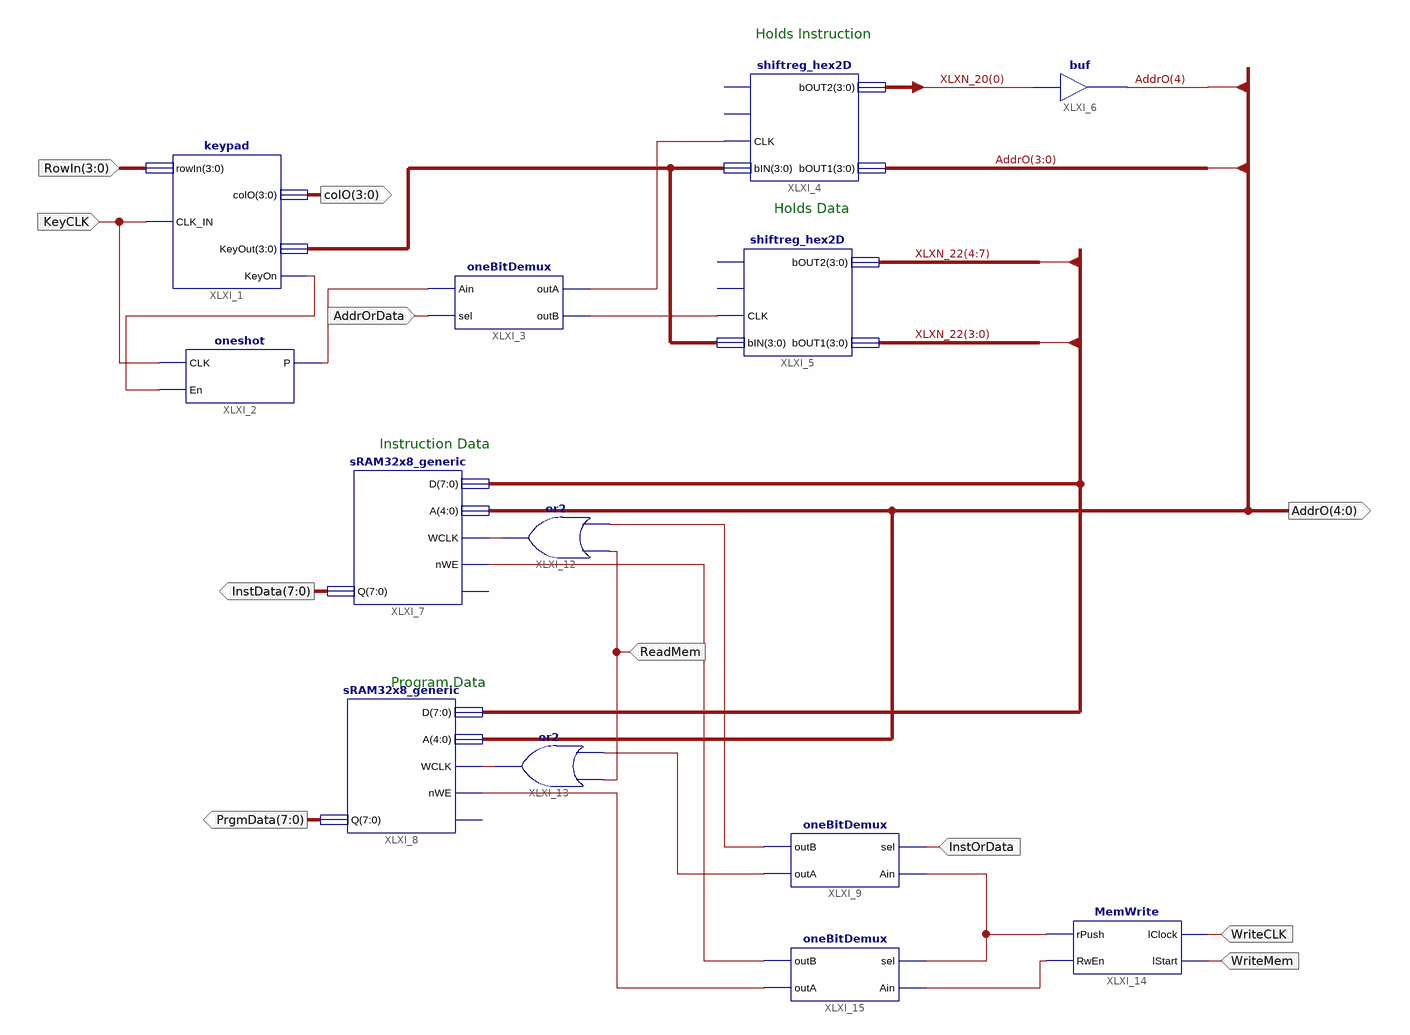
[diagram p0: schematic sheet 1]
// Xilinx ISE schematic KeyAndMem.sch (spartan3e) as structural Verilog: 13 symbols, 11 ports
module KeyAndMem (
  input  [3:0] RowIn,
  input  KeyCLK,
  input  AddrOrData,
  input  InstOrData,
  input  ReadMem,
  input  WriteMem,
  input  WriteCLK,
  output [3:0] colO,
  output [4:0] AddrO,
  output [7:0] InstData,
  output [7:0] PrgmData
);

  wire XLXN_4, XLXN_7, XLXN_9, XLXN_10, XLXN_33, XLXN_34, XLXN_35, XLXN_36, XLXN_38, XLXN_39, XLXN_40,
       XLXN_41;
  wire [3:0] XLXN_11, XLXN_20;
  wire [7:0] XLXN_22;

  keypad XLXI_1 (.rowIn(RowIn), .CLK_IN(KeyCLK), .colO(colO), .KeyOut(XLXN_11), .KeyOn(XLXN_4));
  oneshot XLXI_2 (.CLK(KeyCLK), .En(XLXN_4), .P(XLXN_7));
  oneBitDemux XLXI_3 (.Ain(XLXN_7), .sel(AddrOrData), .outA(XLXN_9), .outB(XLXN_10));
  shiftreg_hex2D XLXI_4 (.CLK(XLXN_9), .bIN(XLXN_11), .bOUT2(XLXN_20), .bOUT1(AddrO[3:0]));  // open: CE, RST
  shiftreg_hex2D XLXI_5 (
    .CLK(XLXN_10), .bIN(XLXN_11), .bOUT2({XLXN_22[4], XLXN_22[5], XLXN_22[6], XLXN_22[7]}),
    .bOUT1(XLXN_22[3:0]));  // open: CE, RST
  buf XLXI_6 (AddrO[4], XLXN_20[0]);
  sRAM32x8_generic XLXI_7 (.nWE(XLXN_40), .WCLK(XLXN_33), .A(AddrO), .D(XLXN_22), .Q(InstData));  // open: nCS
  sRAM32x8_generic XLXI_8 (.nWE(XLXN_41), .WCLK(XLXN_34), .A(AddrO), .D(XLXN_22), .Q(PrgmData));  // open: nCS
  oneBitDemux XLXI_9 (.Ain(XLXN_38), .sel(InstOrData), .outA(XLXN_36), .outB(XLXN_35));
  or XLXI_12 (XLXN_33, XLXN_35, ReadMem);
  or XLXI_13 (XLXN_34, XLXN_36, ReadMem);
  MemWrite XLXI_14 (.lStart(WriteMem), .lClock(WriteCLK), .RwEn(XLXN_39), .rPush(XLXN_38));
  oneBitDemux XLXI_15 (.Ain(XLXN_39), .sel(XLXN_38), .outA(XLXN_41), .outB(XLXN_40));

  // Notes on the sheet:
  //   Holds Instruction
  //   Holds Data
  //   Instruction Data
  //   Program Data
endmodule
